# Altium schematic sheet Kasli-DIOT.SchDoc: Kasli-DIOT
size 420 x 297 mm; EDA_Number: ARTIQ; Projet: ARTIQ/SINARA; Author: G.Kasprowicz; CompanyName: WUT ISE; DrawnBy: F.Świtakowski; Organization: WUT ISE; Address1: PW ISE; Address2: Nowowiejska 15/19 00-665 Warsaw; Address3: gkasprow@gmail.com; DocumentNumber: 7; SheetNumber: 1; SheetTotal: 16; ModifiedBy: -; CheckedDate: -; Title2: TOP; DivGrp: WUT ISE; Designer: F.Świtakowski; ModifiedDate: -; ProjectName: Sensor Box
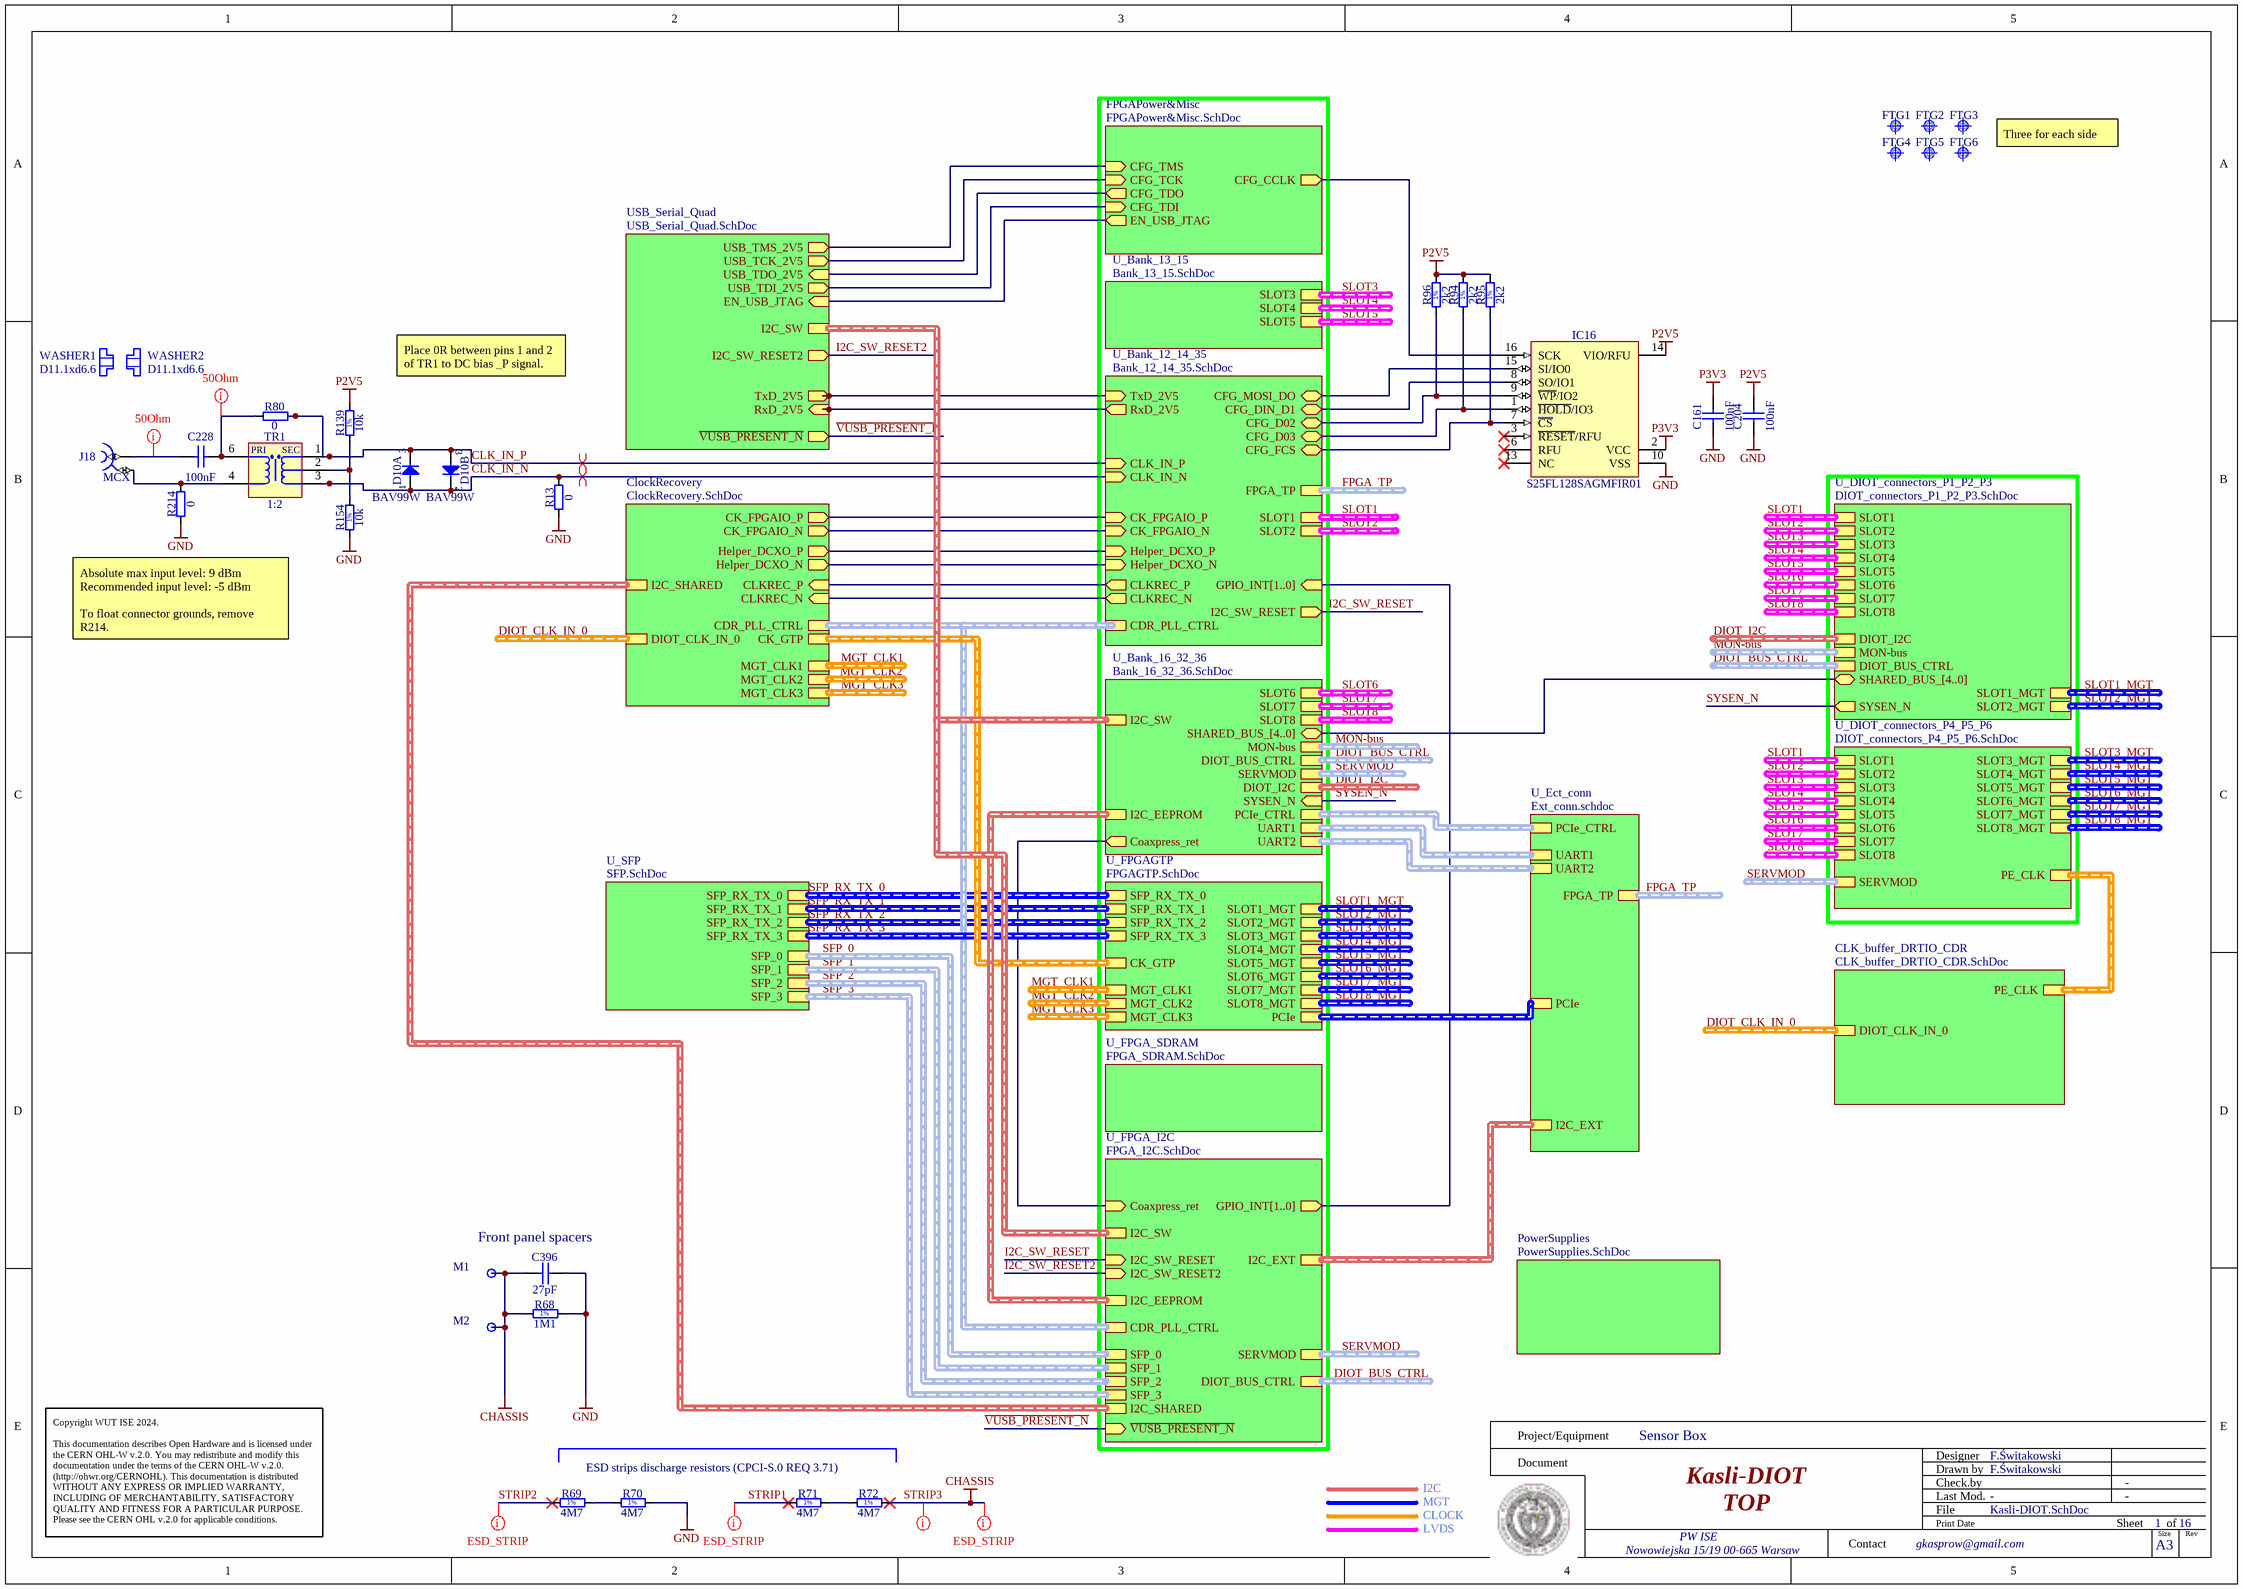
[diagram p0: Kasli-DIOT.SchDoc]

## Parts
C161  100nF  [CAPC1005X55N]
C204  100nF  [CAPC1005X55N]
C228  100nF  [CAPC0603X33N]
C396  27pF  [CAPC1005X55N]
D10  BAV99W  [SOT65P210X110-3N]  (parts A,B of 2)
FTG1  Use only in PCB  [FIDUCIAL_TOP_S100-200]  (value not drawn)  (no BOM)
FTG2  Use only in PCB  [FIDUCIAL_TOP_S100-200]  (value not drawn)
FTG3  Use only in PCB  [FIDUCIAL_TOP_S100-200]  (value not drawn)
FTG4  Use only in PCB  [FIDUCIAL_TOP_S100-200]  (value not drawn)
FTG5  Use only in PCB  [FIDUCIAL_TOP_S100-200]  (value not drawn)
FTG6  Use only in PCB  [FIDUCIAL_TOP_S100-200]  (value not drawn)
IC16  S25FL128SAGMFIR01  [SOIC127P1030X265-16N]
J18  MCX  [AMPHENOL_919-383J-51A]
M1  Plated Hole  [MTG300_600]  (value not drawn)  (no BOM)
M2  Plated Hole  [MTG300_600]  (value not drawn)  (no BOM)
R13  0  [RESC1005X40N]
R68  1M1  [RESC2012X60N]
R69  4M7  [RESC2113X55N]
R70  4M7  [RESC2113X55N]
R71  4M7  [RESC2113X55N]
R72  4M7  [RESC2113X55N]
R80  0  [RESC1005X40N]
R94  2k2  [RESC1005X40N]
R95  2k2  [RESC1005X40N]
R96  2k2  [RESC1005X40N]
R139  10k  [RESC1005X40N]
R154  10k  [RESC1005X40N]
R214  0  [RESC1005X40N]
TR1  1:2  [XFMR_MINI-CIRCUITS_AT1521]
WASHER1  D11.1xd6.6  [Keystone_7687]
WASHER2  D11.1xd6.6  [Keystone_7687]

## Sub-sheets
CLK_buffer_DRTIO_CDR = CLK_buffer_DRTIO_CDR.SchDoc: PE_CLK (harness PE_CLK), DIOT_CLK_IN_0 (harness CLK_DIFF)
ClockRecovery = ClockRecovery.SchDoc: CLKREC_P (in), CLKREC_N (in), CK_FPGAIO_P (out), CK_FPGAIO_N (out), CDR_PLL_CTRL (harness CDR_PLL_CTRL), Helper_DCXO_N (out), Helper_DCXO_P (out), CK_GTP (harness CLK_DIFF), MGT_CLK1 (harness CLK_DIFF), DIOT_CLK_IN_0 (harness CLK_DIFF), MGT_CLK2 (harness CLK_DIFF), MGT_CLK3 (harness CLK_DIFF), I2C_SHARED (harness I2C)
FPGAPower&Misc = FPGAPower&Misc.SchDoc: CFG_CCLK (out), CFG_TMS (in), CFG_TCK (in), CFG_TDO (out), CFG_TDI (in), EN_USB_JTAG (out)
PowerSupplies = PowerSupplies.SchDoc: no entries
U_Bank_12_14_35 = Bank_12_14_35.SchDoc: SLOT2 (harness SLOT), SLOT1 (harness SLOT), CFG_DIN_D1 (bidir), CFG_FCS (bidir), CFG_MOSI_DO (bidir), CFG_D02 (bidir), CFG_D03 (bidir), RxD_2V5 (out), TxD_2V5 (in), CK_FPGAIO_P (in), CK_FPGAIO_N (in), CLKREC_P (out), CLKREC_N (out), GPIO_INT[1..0] (in), CDR_PLL_CTRL (harness CDR_PLL_CTRL), Helper_DCXO_P (in), Helper_DCXO_N (in), I2C_SW_RESET (out), CLK_IN_P (in), CLK_IN_N (in), FPGA_TP (harness FPGA_TESTPOINT)
U_Bank_13_15 = Bank_13_15.SchDoc: SLOT3, SLOT4, SLOT5
U_Bank_16_32_36 = Bank_16_32_36.SchDoc: SLOT6, SLOT7, SLOT8, SHARED_BUS_[4..0] (bidir), MON-bus, DIOT_BUS_CTRL, SERVMOD, DIOT_I2C, SYSEN_N (in), PCIe_CTRL (harness PCIe_CTRL), UART1 (harness UART), UART2 (harness UART), Coaxpress_ret (out), I2C_SW (harness I2C), I2C_EEPROM (harness I2C)
U_DIOT_connectors_P1_P2_P3 = DIOT_connectors_P1_P2_P3.SchDoc: DIOT_BUS_CTRL (harness DIOT_BUS_CTRL), MON-bus (harness MON-bus), DIOT_I2C (harness I2C), SYSEN_N (out), SLOT2 (harness SLOT), SLOT3 (harness SLOT), SLOT1 (harness SLOT), SLOT4 (harness SLOT), SLOT5 (harness SLOT), SLOT6 (harness SLOT), SLOT7 (harness SLOT), SLOT8 (harness SLOT), SLOT1_MGT (harness MGT), SLOT2_MGT (harness MGT), SHARED_BUS_[4..0] (bidir)
U_DIOT_connectors_P4_P5_P6 = DIOT_connectors_P4_P5_P6.SchDoc: SERVMOD (harness SERVMOD), PE_CLK (harness PE_CLK), SLOT2 (harness SLOT), SLOT3 (harness SLOT), SLOT1 (harness SLOT), SLOT4 (harness SLOT), SLOT5 (harness SLOT), SLOT6 (harness SLOT), SLOT7 (harness SLOT), SLOT8 (harness SLOT), SLOT3_MGT (harness MGT), SLOT6_MGT (harness MGT), SLOT4_MGT (harness MGT), SLOT5_MGT (harness MGT), SLOT7_MGT (harness MGT), SLOT8_MGT (harness MGT)
U_Ect_conn = Ext_conn.schdoc: PCIe (harness PCIe), PCIe_CTRL (harness PCIe_CTRL), UART1 (harness UART), UART2 (harness UART), FPGA_TP (harness FPGA_TESTPOINT), I2C_EXT (harness I2C)
U_FPGA_I2C = FPGA_I2C.SchDoc: I2C_SW_RESET (in), SFP_0 (harness SFP), SFP_2 (harness SFP), SFP_1 (harness SFP), ~{VUSB_PRESENT_N} (in), GPIO_INT[1..0] (out), CDR_PLL_CTRL (harness CDR_PLL_CTRL), SFP_3 (harness SFP), I2C_SW_RESET2 (in), Coaxpress_ret (in), SERVMOD (harness SERVMOD), DIOT_BUS_CTRL (harness DIOT_BUS_CTRL), I2C_SW (harness I2C), I2C_EEPROM (harness I2C), I2C_EXT (harness I2C), I2C_SHARED (harness I2C)
U_FPGA_SDRAM = FPGA_SDRAM.SchDoc: no entries
U_FPGAGTP = FPGAGTP.SchDoc: SFP_RX_TX_0 (harness SFP_RX_TX), SFP_RX_TX_1 (harness SFP_RX_TX), SFP_RX_TX_2 (harness SFP_RX_TX), SFP_RX_TX_3 (harness SFP_RX_TX), SLOT1_MGT (harness MGT), SLOT2_MGT (harness MGT), SLOT3_MGT (harness MGT), SLOT4_MGT (harness MGT), SLOT5_MGT (harness MGT), SLOT6_MGT (harness MGT), SLOT7_MGT (harness MGT), SLOT8_MGT (harness MGT), MGT_CLK1 (harness CLK_DIFF), CK_GTP (harness CLK_DIFF), MGT_CLK2 (harness CLK_DIFF), MGT_CLK3 (harness CLK_DIFF), PCIe (harness PCIe)
U_SFP = SFP.SchDoc: SFP_0 (harness SFP), SFP_RX_TX_0 (harness SFP_RX_TX), SFP_2 (harness SFP), SFP_RX_TX_1 (harness SFP_RX_TX), SFP_RX_TX_2 (harness SFP_RX_TX), SFP_1 (harness SFP), SFP_3 (harness SFP), SFP_RX_TX_3 (harness SFP_RX_TX)
USB_Serial_Quad = USB_Serial_Quad.SchDoc: USB_TDO_2V5 (in), RxD_2V5 (in), USB_TMS_2V5 (out), USB_TDI_2V5 (out), USB_TCK_2V5 (out), TxD_2V5 (out), EN_USB_JTAG (in), ~{VUSB_PRESENT_N} (out), I2C_SW_RESET2 (out), I2C_SW (harness I2C)

## Nets
GND: C161.1 C204.1 C396.2 IC16.10(VSS) R13.1 R68.2 R70.2 R154.2 R214.1
P2V5: C204.2 IC16.14(VIO/RFU) R94.2 R95.2 R96.2 R139.1
P3V3: C161.2 IC16.2(VCC)
STRIP3: C396.1 M1.1 M2.1 R68.1 R72.2  [also labelled CHASSIS]
~{VUSB_PRESENT_N}: sheet U_FPGA_I2C/~{VUSB_PRESENT_N}, sheet USB_Serial_Quad/~{VUSB_PRESENT_N}
CLK_IN_N: D10.1(A) D10.2(C) R13.2 TR1.3(S) ; sheet U_Bank_12_14_35/CLK_IN_N
CLK_IN_P: D10.3(COMAC) R80.2 TR1.1(SDOT) ; sheet U_Bank_12_14_35/CLK_IN_P
I2C_SW_RESET: sheet U_FPGA_I2C/I2C_SW_RESET, sheet U_Bank_12_14_35/I2C_SW_RESET
I2C_SW_RESET2: sheet U_FPGA_I2C/I2C_SW_RESET2, sheet USB_Serial_Quad/I2C_SW_RESET2
STRIP1: R71.1
STRIP2: R69.1
SYSEN_N: sheet U_DIOT_connectors_P1_P2_P3/SYSEN_N, sheet U_Bank_16_32_36/SYSEN_N
NetC228_1: C228.1 J18.1
NetC228_2: C228.2 R80.1 TR1.6(PDOT)
NetIC16_1: IC16.1(~{HOLD}/IO3) R94.1 ; sheet U_Bank_12_14_35/CFG_D03
NetIC16_7: IC16.7(~{CS}) R95.1 ; sheet U_Bank_12_14_35/CFG_FCS
NetIC16_8: IC16.8(SO/IO1) ; sheet U_Bank_12_14_35/CFG_DIN_D1
NetIC16_9: IC16.9(~{WP}/IO2) R96.1 ; sheet U_Bank_12_14_35/CFG_D02
NetIC16_15: IC16.15(SI/IO0) ; sheet U_Bank_12_14_35/CFG_MOSI_DO
NetIC16_16: IC16.16(SCK) ; sheet FPGAPower&Misc/CFG_CCLK
NetJ18_2: J18.2 R214.2 TR1.4(P)
NetR69_2: R69.2 R70.1
NetR71_2: R71.2 R72.1
NetR139_2: R139.2 R154.1 TR1.2(NC)
(unnamed): sheet ClockRecovery/CLKREC_P, sheet U_Bank_12_14_35/CLKREC_P
(unnamed): sheet ClockRecovery/CLKREC_N, sheet U_Bank_12_14_35/CLKREC_N
(unnamed): sheet ClockRecovery/CK_FPGAIO_P, sheet U_Bank_12_14_35/CK_FPGAIO_P
(unnamed): sheet ClockRecovery/CK_FPGAIO_N, sheet U_Bank_12_14_35/CK_FPGAIO_N
(unnamed): sheet ClockRecovery/Helper_DCXO_N, sheet U_Bank_12_14_35/Helper_DCXO_N
(unnamed): sheet ClockRecovery/Helper_DCXO_P, sheet U_Bank_12_14_35/Helper_DCXO_P
(unnamed): sheet FPGAPower&Misc/CFG_TMS, sheet USB_Serial_Quad/USB_TMS_2V5
(unnamed): sheet FPGAPower&Misc/CFG_TCK, sheet USB_Serial_Quad/USB_TCK_2V5
(unnamed): sheet FPGAPower&Misc/CFG_TDO, sheet USB_Serial_Quad/USB_TDO_2V5
(unnamed): sheet FPGAPower&Misc/CFG_TDI, sheet USB_Serial_Quad/USB_TDI_2V5
(unnamed): sheet FPGAPower&Misc/EN_USB_JTAG, sheet USB_Serial_Quad/EN_USB_JTAG
(unnamed): sheet U_FPGA_I2C/Coaxpress_ret, sheet U_Bank_16_32_36/Coaxpress_ret
(unnamed): sheet USB_Serial_Quad/RxD_2V5, sheet U_Bank_12_14_35/RxD_2V5
(unnamed): sheet USB_Serial_Quad/TxD_2V5, sheet U_Bank_12_14_35/TxD_2V5

Not connected (* = marked no-connect by the designer): IC16 3(~{RESET}/RFU)* 6(RFU)* 13(NC)*

## Buses and harness runs
bus sheet U_Bank_12_14_35/GPIO_INT[1..0] = sheet U_FPGA_I2C/GPIO_INT[1..0]
bus sheet U_Bank_16_32_36/SHARED_BUS_[4..0] = sheet U_DIOT_connectors_P1_P2_P3/SHARED_BUS_[4..0]
harness DIOT_BUS_CTRL = sheet U_Bank_16_32_36/DIOT_BUS_CTRL
harness DIOT_BUS_CTRL = sheet U_DIOT_connectors_P1_P2_P3/DIOT_BUS_CTRL
harness DIOT_BUS_CTRL = sheet U_FPGA_I2C/DIOT_BUS_CTRL
harness DIOT_CLK_IN_0 = sheet CLK_buffer_DRTIO_CDR/DIOT_CLK_IN_0
harness DIOT_CLK_IN_0 = sheet ClockRecovery/DIOT_CLK_IN_0
harness DIOT_I2C = sheet U_Bank_16_32_36/DIOT_I2C
harness DIOT_I2C = sheet U_DIOT_connectors_P1_P2_P3/DIOT_I2C
harness FPGA_TP = sheet U_Bank_12_14_35/FPGA_TP
harness FPGA_TP = sheet U_Ect_conn/FPGA_TP
harness MGT_CLK1 = sheet ClockRecovery/MGT_CLK1
harness MGT_CLK1 = sheet U_FPGAGTP/MGT_CLK1
harness MGT_CLK2 = sheet ClockRecovery/MGT_CLK2
harness MGT_CLK2 = sheet U_FPGAGTP/MGT_CLK2
harness MGT_CLK3 = sheet ClockRecovery/MGT_CLK3
harness MGT_CLK3 = sheet U_FPGAGTP/MGT_CLK3
harness MON-bus = sheet U_Bank_16_32_36/MON-bus
harness MON-bus = sheet U_DIOT_connectors_P1_P2_P3/MON-bus
harness SERVMOD = sheet U_Bank_16_32_36/SERVMOD
harness SERVMOD = sheet U_DIOT_connectors_P4_P5_P6/SERVMOD
harness SERVMOD = sheet U_FPGA_I2C/SERVMOD
harness SFP_0 = sheet U_FPGA_I2C/SFP_0 = sheet U_SFP/SFP_0
harness SFP_1 = sheet U_FPGA_I2C/SFP_1 = sheet U_SFP/SFP_1
harness SFP_2 = sheet U_FPGA_I2C/SFP_2 = sheet U_SFP/SFP_2
harness SFP_3 = sheet U_FPGA_I2C/SFP_3 = sheet U_SFP/SFP_3
harness SFP_RX_TX_0 = sheet U_FPGAGTP/SFP_RX_TX_0 = sheet U_SFP/SFP_RX_TX_0
harness SFP_RX_TX_1 = sheet U_FPGAGTP/SFP_RX_TX_1 = sheet U_SFP/SFP_RX_TX_1
harness SFP_RX_TX_2 = sheet U_FPGAGTP/SFP_RX_TX_2 = sheet U_SFP/SFP_RX_TX_2
harness SFP_RX_TX_3 = sheet U_FPGAGTP/SFP_RX_TX_3 = sheet U_SFP/SFP_RX_TX_3
harness sheet CLK_buffer_DRTIO_CDR/PE_CLK = sheet U_DIOT_connectors_P4_P5_P6/PE_CLK
harness sheet ClockRecovery/CDR_PLL_CTRL = sheet U_Bank_12_14_35/CDR_PLL_CTRL = sheet U_FPGA_I2C/CDR_PLL_CTRL
harness sheet ClockRecovery/CK_GTP = sheet U_FPGAGTP/CK_GTP
harness sheet ClockRecovery/I2C_SHARED = sheet U_FPGA_I2C/I2C_SHARED
harness sheet U_Bank_16_32_36/I2C_EEPROM = sheet U_FPGA_I2C/I2C_EEPROM
harness sheet U_Bank_16_32_36/I2C_SW = sheet U_FPGA_I2C/I2C_SW = sheet USB_Serial_Quad/I2C_SW
harness sheet U_Bank_16_32_36/PCIe_CTRL = sheet U_Ect_conn/PCIe_CTRL
harness sheet U_Bank_16_32_36/UART1 = sheet U_Ect_conn/UART1
harness sheet U_Bank_16_32_36/UART2 = sheet U_Ect_conn/UART2
harness sheet U_Ect_conn/I2C_EXT = sheet U_FPGA_I2C/I2C_EXT
harness sheet U_Ect_conn/PCIe = sheet U_FPGAGTP/PCIe
harness SLOT1 = sheet U_Bank_12_14_35/SLOT1
harness SLOT1 = sheet U_DIOT_connectors_P1_P2_P3/SLOT1
harness SLOT1 = sheet U_DIOT_connectors_P4_P5_P6/SLOT1
harness SLOT1_MGT = sheet U_DIOT_connectors_P1_P2_P3/SLOT1_MGT
harness SLOT1_MGT = sheet U_FPGAGTP/SLOT1_MGT
harness SLOT2 = sheet U_Bank_12_14_35/SLOT2
harness SLOT2 = sheet U_DIOT_connectors_P1_P2_P3/SLOT2
harness SLOT2 = sheet U_DIOT_connectors_P4_P5_P6/SLOT2
harness SLOT2_MGT = sheet U_DIOT_connectors_P1_P2_P3/SLOT2_MGT
harness SLOT2_MGT = sheet U_FPGAGTP/SLOT2_MGT
harness SLOT3 = sheet U_Bank_13_15/SLOT3
harness SLOT3 = sheet U_DIOT_connectors_P1_P2_P3/SLOT3
harness SLOT3 = sheet U_DIOT_connectors_P4_P5_P6/SLOT3
harness SLOT3_MGT = sheet U_DIOT_connectors_P4_P5_P6/SLOT3_MGT
harness SLOT3_MGT = sheet U_FPGAGTP/SLOT3_MGT
harness SLOT4 = sheet U_Bank_13_15/SLOT4
harness SLOT4 = sheet U_DIOT_connectors_P1_P2_P3/SLOT4
harness SLOT4 = sheet U_DIOT_connectors_P4_P5_P6/SLOT4
harness SLOT4_MGT = sheet U_DIOT_connectors_P4_P5_P6/SLOT4_MGT
harness SLOT4_MGT = sheet U_FPGAGTP/SLOT4_MGT
harness SLOT5 = sheet U_Bank_13_15/SLOT5
harness SLOT5 = sheet U_DIOT_connectors_P1_P2_P3/SLOT5
harness SLOT5 = sheet U_DIOT_connectors_P4_P5_P6/SLOT5
harness SLOT5_MGT = sheet U_DIOT_connectors_P4_P5_P6/SLOT5_MGT
harness SLOT5_MGT = sheet U_FPGAGTP/SLOT5_MGT
harness SLOT6 = sheet U_Bank_16_32_36/SLOT6
harness SLOT6 = sheet U_DIOT_connectors_P1_P2_P3/SLOT6
harness SLOT6 = sheet U_DIOT_connectors_P4_P5_P6/SLOT6
harness SLOT6_MGT = sheet U_DIOT_connectors_P4_P5_P6/SLOT6_MGT
harness SLOT6_MGT = sheet U_FPGAGTP/SLOT6_MGT
harness SLOT7 = sheet U_Bank_16_32_36/SLOT7
harness SLOT7 = sheet U_DIOT_connectors_P1_P2_P3/SLOT7
harness SLOT7 = sheet U_DIOT_connectors_P4_P5_P6/SLOT7
harness SLOT7_MGT = sheet U_DIOT_connectors_P4_P5_P6/SLOT7_MGT
harness SLOT7_MGT = sheet U_FPGAGTP/SLOT7_MGT
harness SLOT8 = sheet U_Bank_16_32_36/SLOT8
harness SLOT8 = sheet U_DIOT_connectors_P1_P2_P3/SLOT8
harness SLOT8 = sheet U_DIOT_connectors_P4_P5_P6/SLOT8
harness SLOT8_MGT = sheet U_DIOT_connectors_P4_P5_P6/SLOT8_MGT
harness SLOT8_MGT = sheet U_FPGAGTP/SLOT8_MGT

## Layout directives
net class 50Ohm: NetC228_1, NetC228_2
net class ESD_STRIP: STRIP1, STRIP2, STRIP3
net class PWR: STRIP3
differential pair: CLK_IN_N, CLK_IN_P

## Notes on the sheet
- Three for each side
- Place 0R between pins 1 and 2 of TR1 to DC bias _P signal.
- (near R214) Absolute max input level: 9 dBm
  Recommended input level: -5 dBm
  To float connector grounds, remove R214.
- Front panel spacers
- ESD strips discharge resistors (CPCI-S.0 REQ 3.71)
- I2C
- MGT
- CLOCK
- LVDS
- Project/Equipment
- Document
- Designer
- Drawn by
- Check.by
- Copyright WUT ISE 2024.
  This documentation describes Open Hardware and is licensed under the CERN OHL-W v.2.0. You may redistribute and modify this documentation under the terms of the CERN OHL-W v.2.0. (http://ohwr.org/CERNOHL). This documentation is distributed WITHOUT ANY EXPRESS OR IMPLIED WARRANTY, INCLUDING OF MERCHANTABILITY, SATISFACTORY QUALITY AND FITNESS FOR A PARTICULAR PURPOSE. Please see the CERN OHL v.2.0 for applicable conditions.
- Contact
- File
- Last Mod.
- Print Date
- Sheet
- Size
- A3
- of
- Rev
- (in symbol R0402_2K2_1%_0.0625W_100PPM) 1%
- (in symbol R0402_10K_1%_0.0625W_100PPM) 1%
- (in symbol R0805_1M1_1%_0.125W_100PPM) 1%
- (in symbol R0805_4M7_1%_0.125W_100PPM_VISHAY_CRCW e3) 1%
- (in symbol XFMR_MINI-CIRCUITS_TC2-1TX+) PRI; SEC

## Library data of the parts
C161 C204 = CC0402_100NF_16V_10%_X7R: Non-polarised capacitor; Part Description: SMD Multilayer Chip Ceramic Capacitor; Manufacturer: GENERIC; Manufacturer1 Part Number: GRM155R71C104KA88D; Voltage: 16V; TC: X7R; Tolerance: ±10%; Part Number: CC0402_100NF_16V_10%_X7R; Component Kind: Standard; Component Type: Standard; Pin Count: 2; Value: 100nF; Status: Not Recommended; Manufacturer Part Number: CC0402_100NF_16V_10%_X7R; Case: 0402; Mounted: Yes; Socket: No; SMD: Yes; Sense: No; Manufacturer1 Example: MURATA; Manufacturer1 ComponentHeight: 0.55mm; HelpURL: \\cern.ch\dfs\Applications\Altium\Datasheets\CC0402_X7R_MURATA_GRM.pdf; Author: CERN DEM JLC; CreateDate: 05/12/2013; LatestRevisionDate: 03/12/2007
C228 = CC0201_100NF_6.3V_10%_X5R: Non-polarised capacitor; Part Description: SMD Multilayer Chip Ceramic Capacitor; Manufacturer: GENERIC; Manufacturer1 Part Number: 02016D104KAT2A; Voltage: 6.3V; TC: X5R; Tolerance: ±10%; Part Number: CC0201_100NF_6.3V_10%_X5R; Component Kind: Standard; Component Type: Standard; Pin Count: 2; Value: 100nF; Status: Not Recommended; Manufacturer Part Number: CC0201_100NF_6.3V_10%_X5R; Case: 0201; Mounted: Yes; Socket: No; SMD: Yes; Sense: No; Manufacturer1 Example: AVX; Manufacturer1 ComponentHeight: 0.33mm; HelpURL: \\cern.ch\dfs\Applications\Altium\Datasheets\CC0201_X5R_AVX.pdf; Author: CERN DEM JLC; CreateDate: 2007-12-03; LatestRevisionDate: 2007-12-03
C396 = CC0402_27PF_50V_5%_C0G: Non-polarised capacitor; Part Description: SMD Multilayer Chip Ceramic Capacitor; Manufacturer: GENERIC; Manufacturer1 Part Number: C0402C270J5GACTU; Voltage: 50V; TC: C0G/NP0; Tolerance: ±5%; Part Number: CC0402_27PF_50V_5%_C0G; Component Kind: Standard; Component Type: Standard; Pin Count: 2; Value: 27pF; Status: Preferred; Manufacturer Part Number: CC0402_27PF_50V_5%_C0G; Case: 0402; Mounted: Yes; Socket: No; SMD: Yes; Manufacturer1 Example: KEMET; Manufacturer1 ComponentHeight: 0.55mm; HelpURL: \\cern.ch\dfs\Applications\Altium\Datasheets\CC0402_C0G_KEMET_(Commercial Grade).pdf; Author: CERN DEM JLC; CreateDate: 25/10/2012; LatestRevisionDate: 22/04/2015; Sense: No
D10 = BAV99W-7-F: Serial Diode; Part Description: Dual Surface Mount Switching Diode; Manufacturer: DIODES INCORPORATED; Voltage: 75V; Power: 200mW; PressFit: No; Bonding: No; Part Number: BAV99W-7-F; Component Kind: Standard; Component Type: Standard; Device: BAV99W; PackageDescription: SOT323, 0.65mm Pitch; 3 Pin, 1.25mm W X 2.00mm L X 1.10mm H body, IPC Medium Density; Manufacturer Part Number: BAV99W; Pin Count: 3; Case: SOT323; Mounted: Yes; Socket: No; SMD: Yes; Sense: No; ComponentHeight: 1.10mm; HelpURL: \\cern.ch\dfs\Applications\Altium\Datasheets\BAV99W.pdf; Author: CERN DEM MR; CreateDate: 10.02.2016; LatestRevisionDate: 10.02.2016
FTG1-FTG6 = FIDUCIAL_TARGET_S100-200: Fiducial Target; Part Description: Square Fiducial Target, Top Layer, 1.0mm, Top Solder 2.0mm, Keepout =2.0mm; Mounted: No; Part Number: FIDUCIAL_TARGET_S100-200; Component Type: Standard (No BOM); Pin Count: 1; Family: Fiducial; Socket: No; SMD: Yes; Sense: No; Status: None; ComponentHeight: 0mm; HelpURL: Undefined; Author: CERN DEM JLC; CreateDate: 09.02.2010; LatestRevisionDate: 04.04.2012; PackageDescription: Square Fiducial Target, Top Layer, 1.0mm, Top Solder 2.0mm, Keepout =2.0mm
  FTG2-FTG6: Component Kind: Standard (No BOM)
IC16 = S25FL128SAGMFIR01: 128Mbit, MirrorBit® Flash Non-Volatile Memory CMOS 3.0 Volt Core with Versatile I/O Serial Peripheral Interface with Multi-I/O; Part Description: 128Mbit, 133MHz, MirrorBit® Flash Non-Volatile Memory CMOS 3V Core with Versatile I/O Serial Peripheral Interface with Multi-I/O; Manufacturer: SPANSION; PressFit: No; Bonding: No; Part Number: S25FL128SAGMFIR01; Component Kind: Standard; Component Type: Standard; Device: S25FL128SAGMFIR01; PackageDescription: SOIC 16, Pitch 1.27mm - Body 7.5x10.3mm, IPC Medium Density; Manufacturer Part Number: S25FL128SAGMFIR01; Pin Count: 11; Case: SOIC16; Mounted: Yes; Socket: No; SMD: Yes; Sense: No; ComponentHeight: 2.65mm; HelpURL: \\cern.ch\dfs\Applications\Altium\Datasheets\S25FL128SAGMFIR01.pdf; Author: CERN DEM JLC; CreateDate: 2014-07-10; LatestRevisionDate: 2014-07-10
J18 = AMPHENOL_919-383J-51A: Part Description: 50 Ohms, RF Connector, MCX Right Angle PCB Receptacle Jack; PressFit: No; Part Number: AMPHENOL_919-383J-51A; Component Kind: Standard; Component Type: Standard; Pin Count: 5; Family: MCX; Mounted: Yes; Socket: No; SMD: No; Sense: No; Status: None; Manufacturer: AMPHENOL; Manufacturer Part Number: 919-383J-51A; ComponentHeight: 6mm; HelpURL: \\cern.ch\dfs\Applications\Altium\Datasheets\AMPHENOL_919-383J-51A.pdf; Author: CERN DEM BC; CreateDate: 31.01.2019; LatestRevisionDate: 31.01.2019
M1 M2 = PLATED_HOLE3.0_PAD6.0: Single Terminal Socket; Part Description: Plated Through Hole: Hole Dia.=3.0mm Pad Dia.=6.0mm; Mounted: No; Table: Pads; Part Number: PLATED_HOLE3.0_PAD6.0; Component Type: Standard (No BOM); Designator: Single Terminal Socket; Library Reference: Single Terminal Socket; Pin Count: 1; Family: Plated Hole; Socket: No; SMD: No; Status: None; ComponentHeight: 0mm; Author: CERN DEM JLC; CreateDate: 26.05.2008; LatestRevisionDate: 26.05.2008; PackageDescription: Plated Through Hole: Hole Dia.=3.0mm Pad Dia.=6.0mm
R13 R80 R214 = R0402_0R_JUMPER: Resistor; Part Description: 1A (0.05R Max DC Resistance) Zero Ohm Jumper; Manufacturer: GENERIC; Manufacturer1 Part Number: 232270591001L; PressFit: No; Part Number: R0402_0R_JUMPER; Component Kind: Standard; Component Type: Standard; Pin Count: 2; Value: 0; Status: Not Recommended; Manufacturer Part Number: R0402_0R_JUMPER; Case: 0402; Mounted: Yes; Sense: No; Socket: No; SMD: Yes; Manufacturer1 Example: YAGEO PHYCOMP; Manufacturer1 ComponentHeight: 0.4mm; HelpURL: \\cern.ch\dfs\Applications\Altium\Datasheets\R0402_Phycomp_RC0402.pdf; Author: CERN DEM JLC; CreateDate: 03.12.2007; LatestRevisionDate: 17.10.2012
R68 = R0805_1M1_1%_0.125W_100PPM: Resistor - 1%; Part Description: General Purpose Thick Film Chip Resistor; Manufacturer: GENERIC; Manufacturer1 Part Number: NRC10F1104TRF; Power: 0.125W; TC: ±100ppm/°C; PressFit: No; Part Number: R0805_1M1_1%_0.125W_100PPM; Component Kind: Standard; Component Type: Standard; Pin Count: 2; Value: 1M1; Status: Preferred; Tolerance: ±1%; Manufacturer Part Number: R0805_1M1_1%_0.125W_100PPM; Case: 0805; Mounted: Yes; Sense: No; Socket: No; SMD: Yes; Manufacturer1 Example: NIC COMPONENT; Manufacturer1 ComponentHeight: 0.6mm; HelpURL: \\cern.ch\dfs\Applications\Altium\Datasheets\R0805_NIC_NRC.pdf; Author: CERN DEM JLC; CreateDate: 03/12/2007; LatestRevisionDate: 13/03/2008
R69-R72 = R0805_4M7_1%_0.125W_100PPM_VISHAY_CRCW e3: Resistor - 1%; Part Description: 150V, Standard Thick Film Chip Resistor; Manufacturer: VISHAY; Manufacturer Part Number: CRCW08054M70FKEA; Power: 0.125W; TC: ±100ppm/°C; PressFit: No; Part Number: R0805_4M7_1%_0.125W_100PPM_VISHAY_CRCW e3; Component Kind: Standard; Component Type: Standard; Pin Count: 2; Value: 4M7; Status: None; Tolerance: ±1%; Case: 0805; Mounted: Yes; Sense: No; Socket: No; SMD: Yes; ComponentHeight: 0.5mm; HelpURL: \\cern.ch\dfs\Applications\Altium\Datasheets\R0805_VISHAY_CRCW e3.pdf; Author: CERN DEM BR; CreateDate: 27/05/2019; LatestRevisionDate: 27/05/2019
R94-R96 = R0402_2K2_1%_0.0625W_100PPM: Resistor - 1%; Part Description: General Purpose Thick Film Chip Resistor; Manufacturer: GENERIC; Manufacturer1 Part Number: 232270672202L; TC: ±100ppm/°C; PressFit: No; Part Number: R0402_2K2_1%_0.0625W_100PPM; Component Kind: Standard; Component Type: Standard; Pin Count: 2; Value: 2k2; Status: Not Recommended; Power: 0.0625W; Tolerance: ±1%; Manufacturer Part Number: R0402_2K2_1%_0.0625W_100PPM; Case: 0402; Mounted: Yes; Sense: No; Socket: No; SMD: Yes; Manufacturer1 Example: YAGEO PHYCOMP; Manufacturer1 ComponentHeight: 0.4mm; HelpURL: \\cern.ch\dfs\Applications\Altium\Datasheets\R0402_Phycomp_RC0402.pdf; Author: CERN DEM JLC; CreateDate: 03.12.2007; LatestRevisionDate: 17.10.2012; ClassName: Artix
R139 R154 = R0402_10K_1%_0.0625W_100PPM: Resistor - 1%; Part Description: General Purpose Thick Film Chip Resistor; Manufacturer: GENERIC; Manufacturer1 Part Number: 232270671003L; TC: ±100ppm/°C; PressFit: No; Part Number: R0402_10K_1%_0.0625W_100PPM; Component Kind: Standard; Component Type: Standard; Pin Count: 2; Value: 10k; Status: Not Recommended; Power: 0.0625W; Tolerance: ±1%; Manufacturer Part Number: R0402_10K_1%_0.0625W_100PPM; Case: 0402; Mounted: Yes; Sense: No; Socket: No; SMD: Yes; Manufacturer1 Example: YAGEO PHYCOMP; Manufacturer1 ComponentHeight: 0.4mm; HelpURL: \\cern.ch\dfs\Applications\Altium\Datasheets\R0402_Phycomp_RC0402.pdf; Author: CERN DEM JLC; CreateDate: 03.12.2007; LatestRevisionDate: 17.10.2012
TR1 = XFMR_MINI-CIRCUITS_TC2-1TX+: 50 Ohms 3 to 300MHz RF Transformer; Part Number: XFMR_MINI-CIRCUITS_TC2-1TX+; Component Kind: Standard; Component Type: Standard; Pin Count: 5; Value: 1:2; Status: None; Part Description: 50 Ohms 3 to 300MHz RF Transformer; Manufacturer: MINI-CIRCUITS; Manufacturer Part Number: TC2-1TX+; Mounted: Yes; Socket: No; Sense: No; SMD: Yes; ComponentHeight: 4.06mm; HelpURL: \\cern.ch\dfs\Applications\Altium\Datasheets\XFMR_MINI-CIRCUITS_TC2-1TX+.pdf; Author: CERN DEM MR; CreateDate: 18.10.2019; LatestRevisionDate: 18.10.2019
WASHER1 WASHER2 = Keystone_7687: SMA_Shoulder Washer; Part Description: Polyphenylene Sulfide PPS Shoulder Washer; Manufacturer Part Number: 7687; PressFit: No; Part Number: Keystone 7687; Component Kind: Standard; Component Type: Mechanical; Pin Count: 0; PackageDescription: Polyphenylene Sulfide PPS Shoulder Washer; Mounted: Yes; Socket: No; SMD: No; Sense: No; Status: None; Value: D11.1xd6.6; Manufacturer: Keystone; ComponentHeight: 1.91mm; HelpURL: \\cern.ch\dfs\Applications\Altium\Datasheets\AAVID-THERMALLOY_7721-7PPSG.pdf; Author: GK; CreateDate: 28.01.2016; LatestRevisionDate: 28.01.2016